# EasyEDA schematic therm-hub.json
TITLE: Thermostat Hub; REV: 1.0; Date: 2020-12-02; Sheet: 1/1; Company: Explosive Brains Ltd
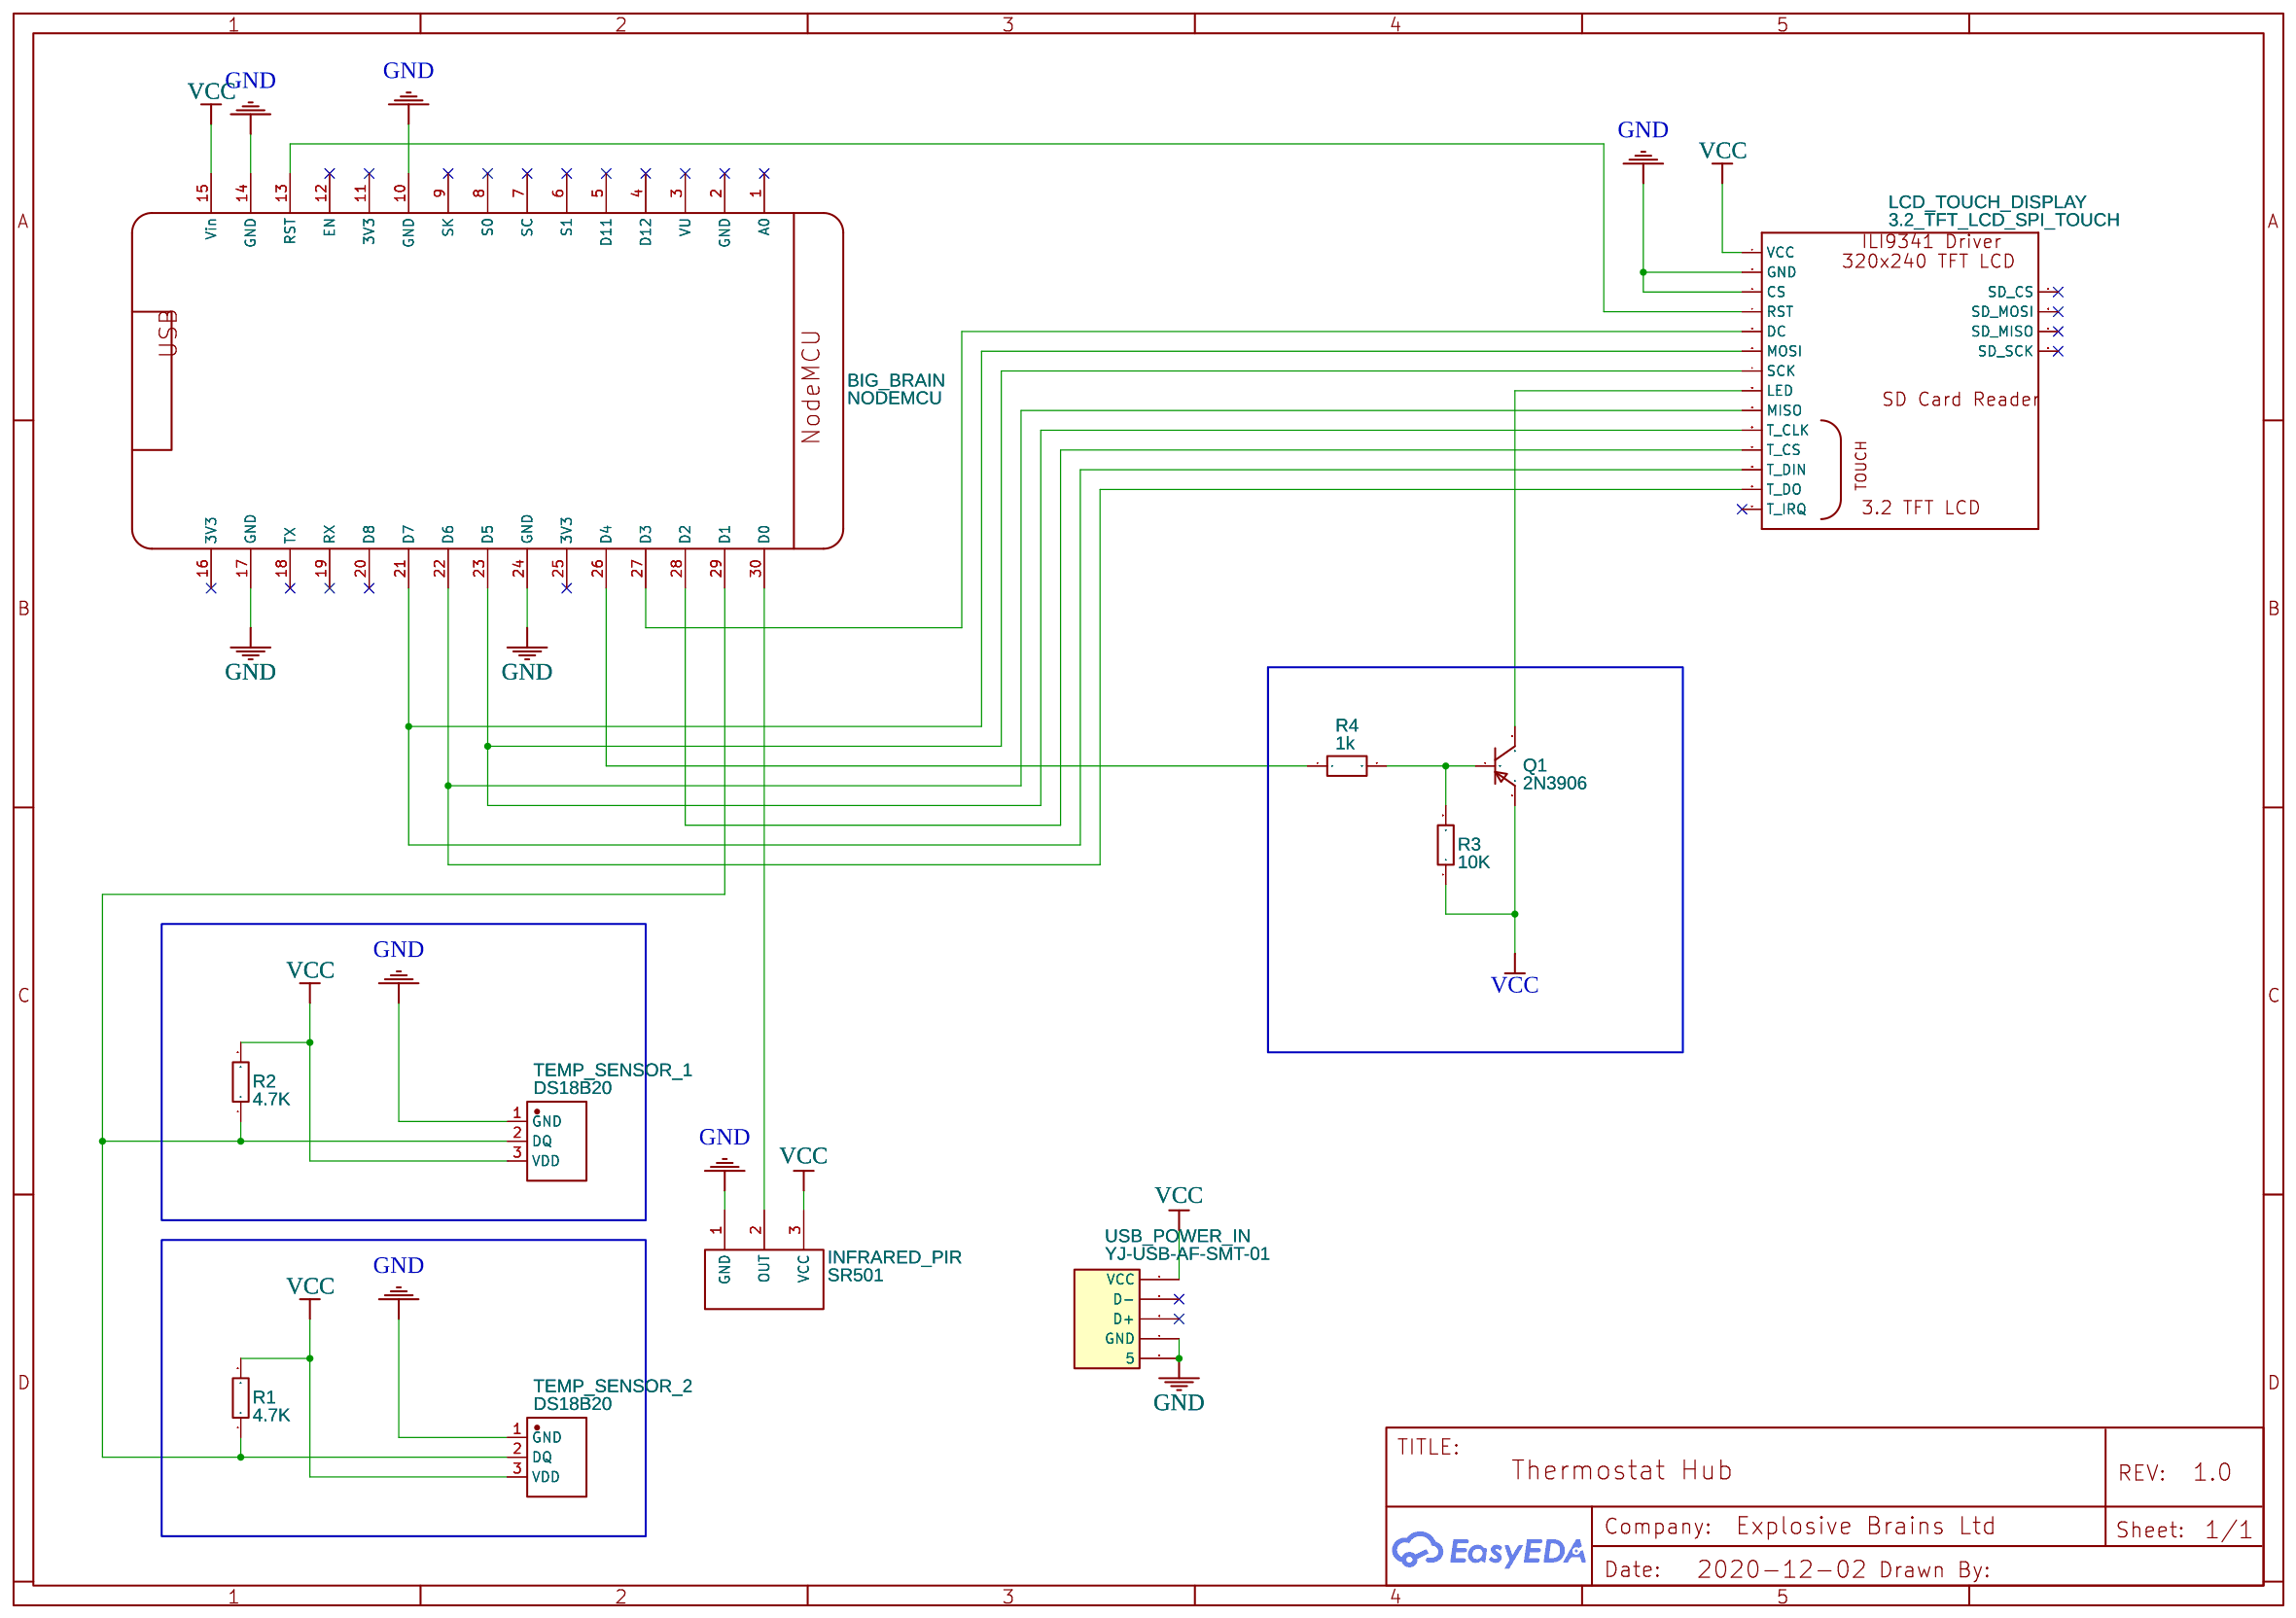
[diagram p0: schematic sheet]

## Parts
BIG_BRAIN  NODEMCU  [NODEMCU]
INFRARED_PIR  SR501  [SR501]
LCD_TOUCH_DISPLAY  3.2_TFT_LCD_SPI_TOUCH  [ILI9341-3.2]
Q1  2N3906  [TO-92-3_L4.9-W3.7-P1.27-L]
R1  4.7K  [RES-TH_BD2.3-L6.5-P10.50-D0.5]
R2  4.7K  [RES-TH_BD2.3-L6.5-P10.50-D0.5]
R3  10K  [RES-TH_BD2.2-L6.5-P10.50-D0.6]
R4  1k  [RES-TH_BD2.2-L6.5-P10.50-D0.9]
TEMP_SENSOR_1  DS18B20  [TO-92-3_L4.9-W3.7-P1.27-L]
TEMP_SENSOR_2  DS18B20  [TO-92-3_L4.9-W3.7-P1.27-L]
USB_POWER_IN  YJ-USB-AF-SMT-01  [USB-A-SMD_FUS270-FSBW5K]

## Library data of the parts
BIG_BRAIN = NODEMCU: Contributor: Byte Electronics
INFRARED_PIR = SR501: Contributor: davide.digesualdo
LCD_TOUCH_DISPLAY = 3.2_TFT_LCD_SPI_TOUCH: Contributor: Martí B
Q1 = 2N3906: Supplier: LCSC; Manufacturer: CJ; image: //image.lceda.cn/szlcsc/C9809.jpg; Supplier Part: C9809; LCSC Assembly: Yes; SMT Type: Extend
R1 R2 = CF1/4W-4.7KΩ±5% T52: Supplier: LCSC; Supplier Part: C120071; Manufacturer: Chian Chia Elec; Contributor: LCSC
R3 = CFR0W4J0103A50: Supplier: LCSC; Manufacturer: UniOhm; Supplier Part: C61299; LCSC Assembly: Yes; SMT Type: Extend
R4 = CFR0W4J0102A50_C66649: Supplier: LCSC; Supplier Part: C66649; Manufacturer: Uniroyal Elec; Manufacturer Part: CFR0W4J0102A50; Contributor: LCSC; LCSC Assembly: Yes; SMT Type: Extend
TEMP_SENSOR_1 TEMP_SENSOR_2 = DS18B20: Supplier: LCSC; Supplier Part: C376006; Manufacturer: Youtai Semiconductor Co., Ltd.; Contributor: LCSC
USB_POWER_IN = YJ-USB-AF-SMT-01: Supplier: LCSC; Manufacturer: ValuePro; image: //image.lceda.cn/szlcsc/C8328.jpg; Supplier Part: C8328

## Nets
GND: BIG_BRAIN.10(GND) BIG_BRAIN.14(GND) BIG_BRAIN.17(GND) BIG_BRAIN.24(GND) INFRARED_PIR.1(GND) LCD_TOUCH_DISPLAY.2(GND) LCD_TOUCH_DISPLAY.3(CS) TEMP_SENSOR_1.1(GND) TEMP_SENSOR_2.1(GND) USB_POWER_IN.4(GND) USB_POWER_IN.5
VCC: BIG_BRAIN.15(Vin) INFRARED_PIR.3(VCC) LCD_TOUCH_DISPLAY.1(VCC) Q1.1(E) R1.2 R2.2 R3.1 TEMP_SENSOR_1.3(VDD) TEMP_SENSOR_2.3(VDD) USB_POWER_IN.1(VCC)
Net-(BIG_BRAIN-13): BIG_BRAIN.13(RST) LCD_TOUCH_DISPLAY.4(RST)
Net-(BIG_BRAIN-21): BIG_BRAIN.21(D7) LCD_TOUCH_DISPLAY.6(MOSI) LCD_TOUCH_DISPLAY.12(T_DIN)
Net-(BIG_BRAIN-22): BIG_BRAIN.22(D6) LCD_TOUCH_DISPLAY.9(MISO) LCD_TOUCH_DISPLAY.13(T_DO)
Net-(BIG_BRAIN-23): BIG_BRAIN.23(D5) LCD_TOUCH_DISPLAY.7(SCK) LCD_TOUCH_DISPLAY.10(T_CLK)
Net-(BIG_BRAIN-26): BIG_BRAIN.26(D4) R4.1
Net-(BIG_BRAIN-27): BIG_BRAIN.27(D3) LCD_TOUCH_DISPLAY.5(DC)
Net-(BIG_BRAIN-28): BIG_BRAIN.28(D2) LCD_TOUCH_DISPLAY.11(T_CS)
Net-(BIG_BRAIN-29): BIG_BRAIN.29(D1) R1.1 R2.1 TEMP_SENSOR_1.2(DQ) TEMP_SENSOR_2.2(DQ)
Net-(BIG_BRAIN-30): BIG_BRAIN.30(D0) INFRARED_PIR.2(OUT)
Net-(LCD_TOUCH_DISPLAY-8): LCD_TOUCH_DISPLAY.8(LED) Q1.3(C)
Net-(Q1-2): Q1.2(B) R3.2 R4.2

Not connected (* = marked no-connect by the designer): BIG_BRAIN 1(A0)* 2(GND)* 3(VU)* 4(D12)* 5(D11)* 6(S1)* 7(SC)* 8(S0)* 9(SK)* 11(3V3)* 12(EN)* 16(3V3)* 18(TX)* 19(RX)* 20(D8)* 25(3V3)*; LCD_TOUCH_DISPLAY 14(T_IRQ)* 15(SD_CS)* 16(SD_MOSI)* 17(SD_MISO)* 18(SD_SCK)*; USB_POWER_IN 2(D-)* 3(D+)*
